# Altium schematic sheet RECEIVER IC.SchDoc
size D
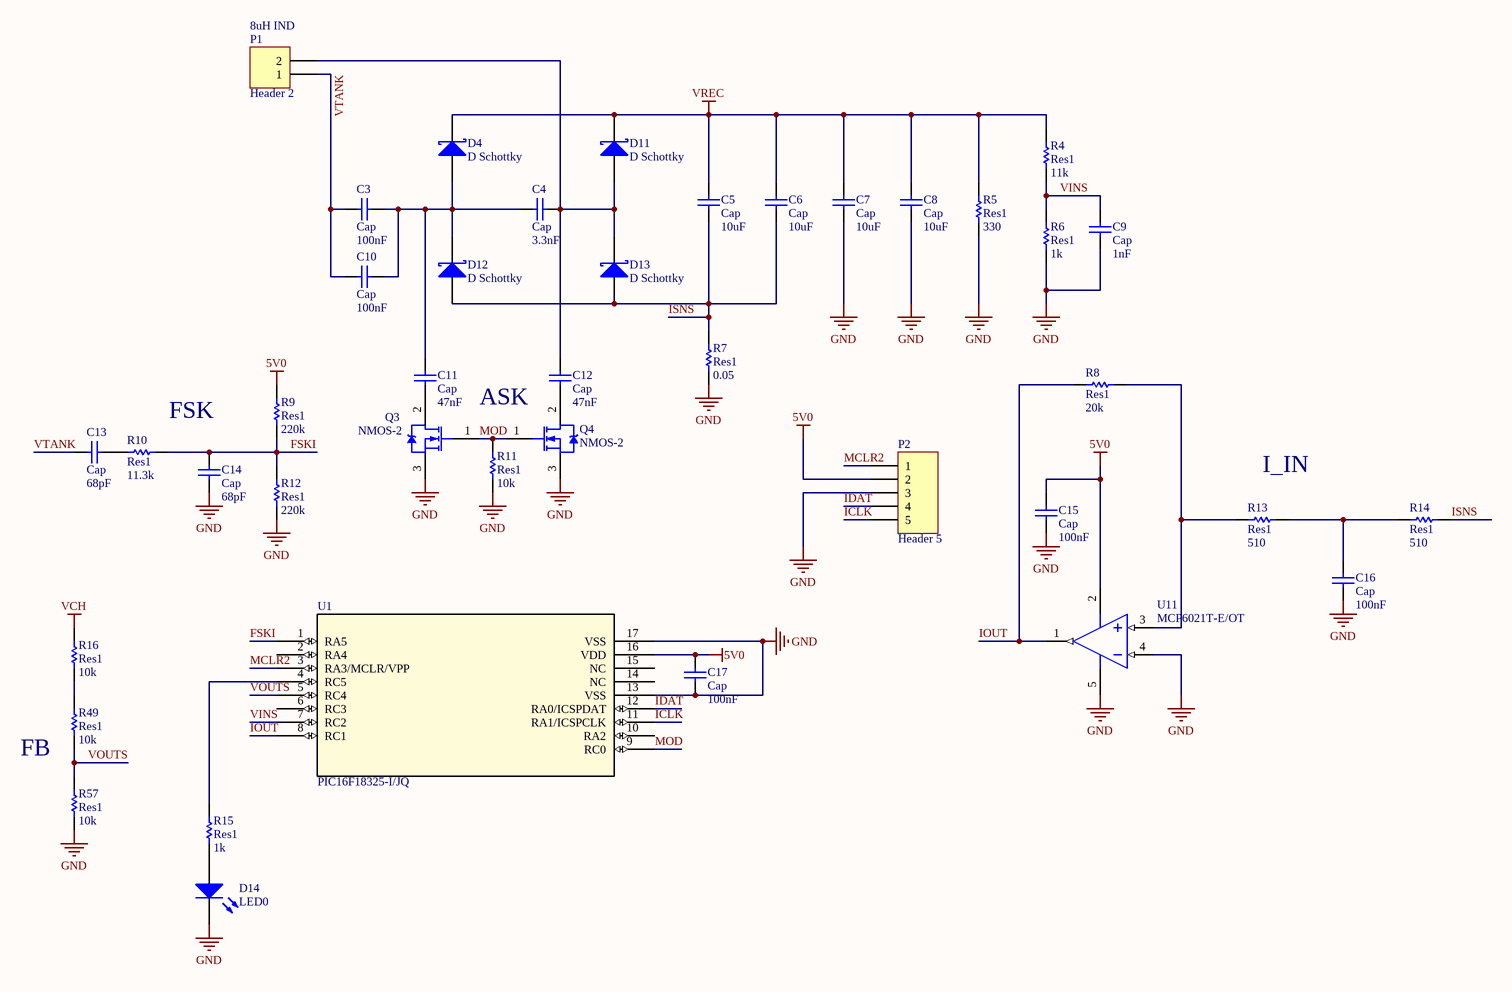
[diagram p0: RECEIVER IC.SchDoc]

## Parts
C3  Cap  value 100nF  [C1206]
C4  Cap  value 3.3nF  [6-0805_M]
C5  Cap  value 10uF  [C1210]
C6  Cap  value 10uF  [C1210]
C7  Cap  value 10uF  [C1210]
C8  Cap  value 10uF  [C1210]
C9  Cap  value 1nF  [1608[0603]]
C10  Cap  value 100nF  [C1206]
C11  Cap  value 47nF  [6-0805_M]
C12  Cap  value 47nF  [6-0805_M]
C13  Cap  value 68pF  [1608[0603]]
C14  Cap  value 68pF  [1608[0603]]
C15  Cap  value 100nF  [1608[0603]]
C16  Cap  value 100nF  [1608[0603]]
C17  Cap  value 100nF  [1608[0603]]
D4  D Schottky  [DIO_RB050LAM_ROM]
D11  D Schottky  [DIO_RB050LAM_ROM]
D12  D Schottky  [DIO_RB050LAM_ROM]
D13  D Schottky  [DIO_RB050LAM_ROM]
D14  LED0  [1608[0603]]
P1  Header 2  [2-1445096-2]
P2  Header 5  [HDR1X5]
Q3  NMOS-2  [SOT-23_M]
Q4  NMOS-2  [SOT-23_M]
R4  Res1  value 11k  [1608[0603]]
R5  Res1  value 330  [C1206]
R6  Res1  value 1k  [1608[0603]]
R7  Res1  value 0.05  [C1206]
R8  Res1  value 20k  [1608[0603]]
R9  Res1  value 220k  [1608[0603]]
R10  Res1  value 11.3k  [1608[0603]]
R11  Res1  value 10k  [1608[0603]]
R12  Res1  value 220k  [1608[0603]]
R13  Res1  value 510  [1608[0603]]
R14  Res1  value 510  [1608[0603]]
R15  Res1  value 1k  [1608[0603]]
R16  Res1  value 10k  [1608[0603]]
R49  Res1  value 10k  [1608[0603]]
R57  Res1  value 10k  [1608[0603]]
U1  PIC16F18325-I/JQ  [UQFN16_JQ_MCH]
U11  MCP6021T-E/OT  [SOT-23-OT5_N]

## Nets
5V0: C15.2 C17.2 P2.2 R9.2 U1.16(VDD) U11.2(VSS)
GND: C7.1 C8.1 C9.1 C14.1 C15.1 C16.1 C17.1 D14.2(K) P2.3 Q3.3(S) Q4.3(S) R5.1 R6.1 R7.1 R11.1 R12.1 R57.1 U1.13(VSS) U1.17(VSS) U11.4(VIN-) U11.5(VDD)
VCH: R16.2
VREC: C5.2 C6.2 C7.2 C8.2 D4.2(K) D11.2(K) R4.2 R5.2
FSKI: C14.2 R9.1 R10.2 R12.2 U1.1(RA5)
ICLK: P2.5 U1.11(RA1/ICSPCLK)
IDAT: P2.4 U1.12(RA0/ICSPDAT)
IOUT: R8.1 U1.8(RC1) U11.1(VOUT)
ISNS: C5.1 C6.1 D12.1(A) D13.1(A) R7.2 R14.2
MCLR2: P2.1 U1.3(RA3/MCLR/VPP)
MOD: Q3.1(G) Q4.1(G) R11.2 U1.9(RC0)
VINS: C9.2 R4.1 R6.2 U1.7(RC2)
VOUTS: R49.1 R57.2 U1.5(RC4)
VTANK: C3.1 C10.1 C13.1 P1.1
NetC3_2: C3.2 C4.1 C10.2 C11.2 D4.1(A) D12.2(K)
NetC4_2: C4.2 C12.2 D11.1(A) D13.2(K) P1.2
NetC11_1: C11.1 Q3.2(D)
NetC12_1: C12.1 Q4.2(D)
NetC13_2: C13.2 R10.1
NetC16_2: C16.2 R13.2 R14.1
NetD14_1: D14.1(A) R15.1
NetR8_2: R8.2 R13.1 U11.3(VIN+)
NetR15_2: R15.2 U1.4(RC5)
NetR16_1: R16.1 R49.2

Not connected (* = marked no-connect by the designer): U1 2(RA4) 6(RC3) 10(RA2) 14(NC) 15(NC)

## Notes on the sheet
- (near P1) 8uH IND
- ASK
- FSK
- (near R13) I_IN
- FB

## Library data of the parts
C3-C17 = Cap: Capacitor; Published: 8-Jun-2000; LatestRevisionDate: 17-Jul-2002; LatestRevisionNote: Re-released for DXP Platform.; PackageReference: RAD-0.3; Publisher: Altium Limited; PackageDescription: Radial Cap, Thru-Hole; 2 Leads; 0.3 in Pin Spacing
D4 D11-D13 = D Schottky: Schottky Diode; Published: 8-Jun-2000; LatestRevisionDate: 17-Jul-2002; LatestRevisionNote: Re-released for DXP Platform.; PackageReference: SMB; Publisher: Altium Limited; PackageDescription: DO-214-AA/SMB; 2 C-Bend Leads; Body 5.3 x 3.6 mm, inc. leads (LxW); Code_JEDEC: DO-214-AA
D14 = LED0: Typical INFRARED GaAs LED; Published: 8-Jun-2000; LatestRevisionDate: 08-Jul-2005; LatestRevisionNote: Mech Layer 1 removed.; PackageReference: LED-0; Publisher: Altium Limited; PackageDescription: LED; 2 Leads
P1 = Header 2: Header, 2-Pin; LatestRevisionDate: 17-Jul-2002; LatestRevisionNote: Re-released for DXP Platform.; Publisher: Altium Limited
P2 = Header 5: Header, 5-Pin; LatestRevisionDate: 17-Jul-2002; LatestRevisionNote: Re-released for DXP Platform.; Publisher: Altium Limited
Q3 Q4 = NMOS-2: N-Channel Power MOSFET; Note: Pin 2 is electrically connected to pin 4.; Published: 8-Jun-2000; LatestRevisionDate: 17-Jul-2002; LatestRevisionNote: Re-released for DXP Platform.; DatasheetVersion: PD-9.814; PackageVersion: Feb-1997; PackageReference: TO-220AB; Publisher: Altium Limited; PackageDescription: TO, Thru-Hole, Vertical, Heatsink Mounted; 3 In-Line Leads; Pitch 2.54 mm; ComponentLink1Description: Manufacturer Link; ComponentLink1URL: http://www.irf.com/
R4-R16 R49 R57 = Res1: Resistor; Published: 8-Jun-2000; LatestRevisionDate: 17-Jul-2002; LatestRevisionNote: Re-released for DXP Platform.; PackageReference: AXIAL-0.3; Publisher: Altium Limited; PackageDescription: Axial Device, Thru-Hole; 2 Leads; 0.3 in Pin Spacing
U1 = PIC16F18325-I/JQ: No Description Available; Vendor: Microchip; Built_By: EMA_Cory; SourceLibrary: Add_to_database_2020-10-27; Datasheet: https://ww1.microchip.com/downloads/en/DeviceDoc/PIC16-L-F18325-18345-Data-Sheet-40001795H.pdf; Manufacturer_Part_Number: PIC16F18325-I/JQ; Copyright: Copyright (C) 2018 Accelerated Designs. All rights reserved; RefDes: RefDes; Type: DEV
U11 = CMP-0187-00449-2: Rail-to-Rail Input/Output, 10 MHz Operational Amplifier, 5-Pin SOT-23, Extended Temperature, Tape and Reel; ComponentLink1Description: Manufacturer URL; ComponentLink3URL: http://www.microchip.com/stellent/groups/techpub_sg/documents/packagingspec/en012702.pdf; PackageVersion: revBB, Aug-2009; PackageReference: SOT-23-OT5; DatasheetVersion: revD, Feb-2009; ComponentLink2Description: Datasheet; PackageDescription: 5-Lead Plastic Small Outline Transistor (OT) [SOT-23]; Code_IPC: SOT23-5; ComponentLink2URL: http://ww1.microchip.com/downloads/en/DeviceDoc/21685d.pdf; ComponentLink3Description: Package Specification; RevisionNote: URLs added.; ComponentLink1URL: http://www.microchip.com/